# Altium schematic sheet PCB_BLU.SchDoc
size A4
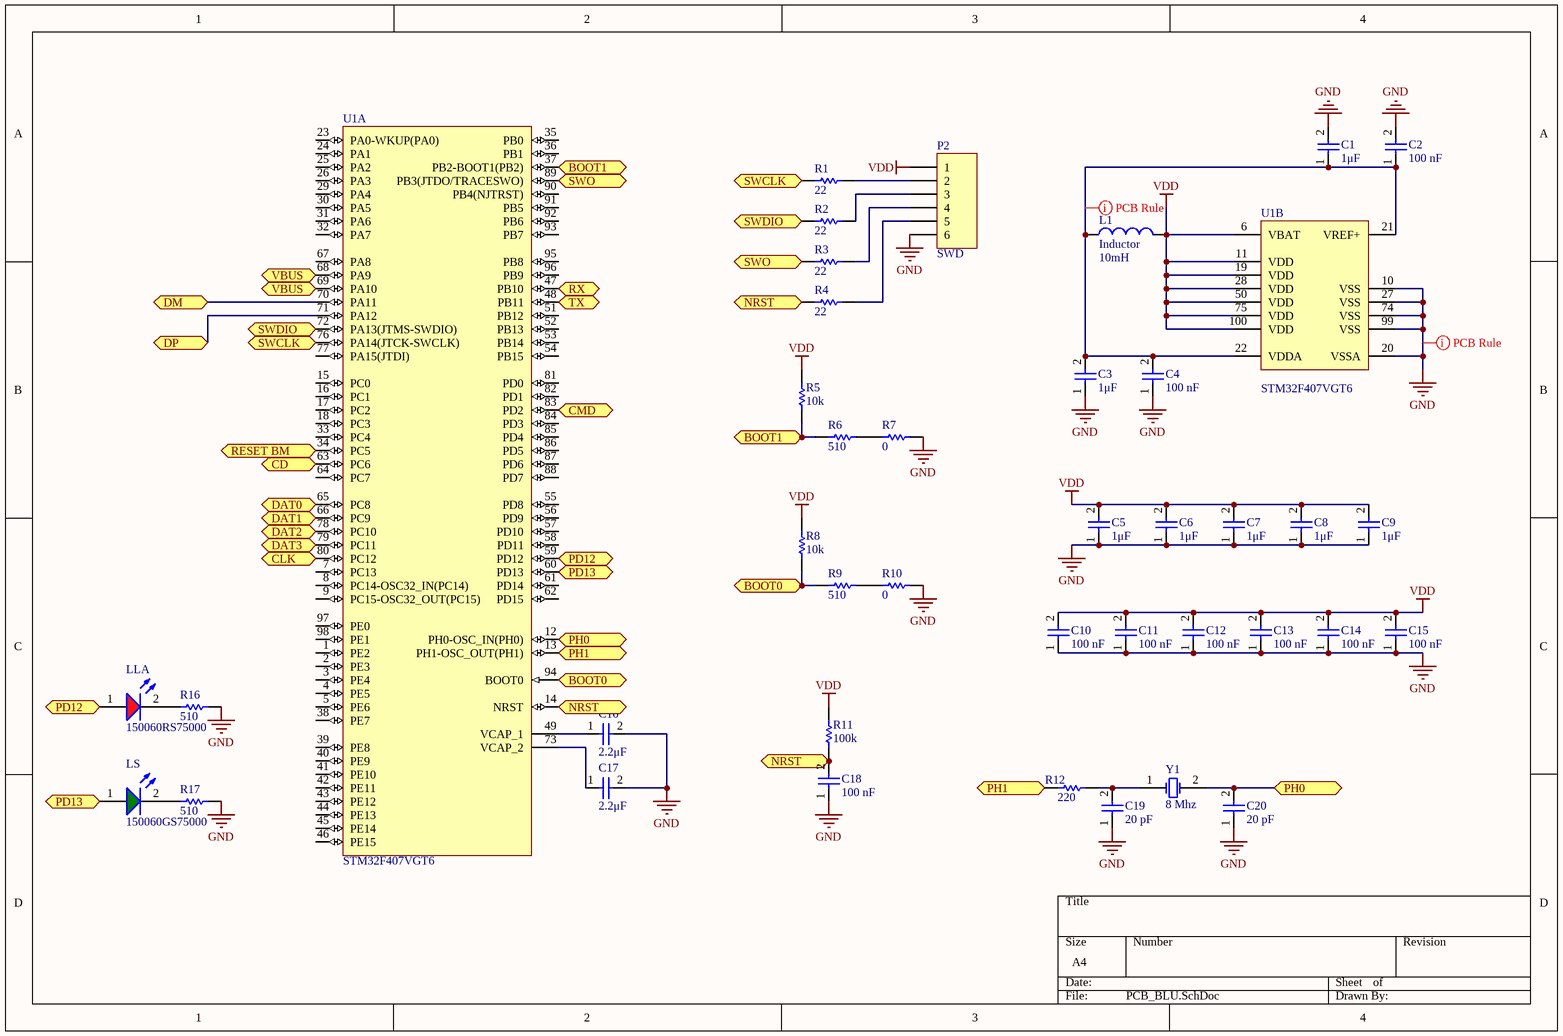
[diagram p0: PCB_BLU.SchDoc]

## Parts
C1  1μF  [WCAP-CSGP 1210, H=1.25mm]
C2  100 nF  [WCAP-CSGP 1206, H=0.8mm]
C3  1μF  [WCAP-CSGP 1210, H=1.25mm]
C4  100 nF  [WCAP-CSGP 1206, H=0.8mm]
C5  1μF  [WCAP-CSGP 1210, H=1.25mm]
C6  1μF  [WCAP-CSGP 1210, H=1.25mm]
C7  1μF  [WCAP-CSGP 1210, H=1.25mm]
C8  1μF  [WCAP-CSGP 1210, H=1.25mm]
C9  1μF  [WCAP-CSGP 1210, H=1.25mm]
C10  100 nF  [WCAP-CSGP 1206, H=0.8mm]
C11  100 nF  [WCAP-CSGP 1206, H=0.8mm]
C12  100 nF  [WCAP-CSGP 1206, H=0.8mm]
C13  100 nF  [WCAP-CSGP 1206, H=0.8mm]
C14  100 nF  [WCAP-CSGP 1206, H=0.8mm]
C15  100 nF  [WCAP-CSGP 1206, H=0.8mm]
C16  2.2μF  [WCAP-CSGP 0805, H=1.25mm]
C17  2.2μF  [WCAP-CSGP 0805, H=1.25mm]
C18  100 nF  [WCAP-CSGP 1206, H=0.8mm]
C19  20 pF  [WCAP-CSGP 0603, H=0.8mm]
C20  20 pF  [WCAP-CSGP 0603, H=0.8mm]
L1  Inductor  value 10mH  [0402-A]
LLA  150060RS75000  [LED_0603_Red]
LS  150060GS75000  [LED_0603_Green]
P2  SWD  [HDR1X6]
R1  22  [RES0402R]
R2  22  [RES0402R]
R3  22  [RES0402R]
R4  22  [RES0402R]
R5  10k  [RES0201R]
R6  510  [RES0201R]
R7  0  [RES0201R]
R8  10k  [RES0201R]
R9  510  [RES0201R]
R10  0  [RES0201R]
R11  100k  [RES0201R]
R12  220  [RES0402R]
R16  510  [RES0402R]
R17  510  [RES0402R]
U1  STM32F407VGT6  [STM-LQFP100_N]  (parts A,B of 2)
Y1  8 Mhz  [3SMXA]

## Ports
BOOT0 (bidir), BOOT1 (bidir), CD (bidir), CLK (bidir), CMD (bidir), DAT0 (bidir), DAT1 (bidir), DAT2 (bidir), DAT3 (bidir), DM (bidir), DP (bidir), NRST (bidir), PD12 (bidir), PD13 (bidir), PH0 (bidir), PH1 (bidir), RESET BM (bidir), RX (bidir), SWCLK (bidir), SWDIO (bidir), SWO (bidir), TX (in), VBUS (bidir)

## Nets
GND: C1.2 C2.2 C3.1 C4.1 C5.1 C6.1 C7.1 C8.1 C9.1 C10.1 C11.1 C12.1 C13.1 C14.1 C15.1 C16.2 C17.2 C18.1 C19.1 C20.1 P2.6 R7.1 R10.1 R16.1 R17.1 U1.10(VSS) U1.20(VSSA) U1.27(VSS) U1.74(VSS) U1.99(VSS)
VDD: C5.2 C6.2 C7.2 C8.2 C9.2 C10.2 C11.2 C12.2 C13.2 C14.2 C15.2 L1.2 P2.1 R5.2 R8.2 R11.1 U1.6(VBAT) U1.11(VDD) U1.19(VDD) U1.28(VDD) U1.50(VDD) U1.75(VDD) U1.100(VDD)
BOOT0: R8.1 R9.2 U1.94(BOOT0) ; port BOOT0
BOOT1: R5.1 R6.2 U1.37(PB2-BOOT1(PB2)) ; port BOOT1
CD: U1.63(PC6) ; port CD
CLK: U1.80(PC12) ; port CLK
CMD: U1.83(PD2) ; port CMD
DAT0: U1.65(PC8) ; port DAT0
DAT1: U1.66(PC9) ; port DAT1
DAT2: U1.78(PC10) ; port DAT2
DAT3: U1.79(PC11) ; port DAT3
DM: U1.70(PA11) ; port DM
DP: U1.71(PA12) ; port DP
NRST: C18.2 R4.2 R11.2 U1.14(NRST) ; port NRST
PD12: LLA.1(A) U1.59(PD12) ; port PD12
PD13: LS.1(A) U1.60(PD13) ; port PD13
PH0: C20.2 U1.12(PH0-OSC_IN(PH0)) Y1.2(OSC2) ; port PH0
PH1: R12.2 U1.13(PH1-OSC_OUT(PH1)) ; port PH1
RESET BM: U1.34(PC5) ; port RESET BM
RX: U1.47(PB10) ; port RX
SWCLK: R1.2 U1.76(PA14(JTCK-SWCLK)) ; port SWCLK
SWDIO: R2.2 U1.72(PA13(JTMS-SWDIO)) ; port SWDIO
SWO: R3.2 U1.89(PB3(JTDO/TRACESWO)) ; port SWO
TX: U1.48(PB11) ; port TX
VBUS: U1.68(PA9) U1.69(PA10) ; port VBUS
NetC1_1: C1.1 C2.1 C3.2 C4.2 L1.1 U1.21(VREF+) U1.22(VDDA)
NetC16_1: C16.1 U1.49(VCAP_1)
NetC17_1: C17.1 U1.73(VCAP_2)
NetC19_2: C19.2 R12.1 Y1.1(OSC1)
NetLLA_2: LLA.2(C) R16.2
NetLS_2: LS.2(C) R17.2
NetP2_2: P2.2 R1.1
NetP2_3: P2.3 R2.1
NetP2_4: P2.4 R3.1
NetP2_5: P2.5 R4.1
NetR6_1: R6.1 R7.2
NetR9_1: R9.1 R10.2

Not connected (* = marked no-connect by the designer): U1 1(PE2) 2(PE3) 3(PE4) 4(PE5) 5(PE6) 7(PC13) 8(PC14-OSC32_IN(PC14)) 9(PC15-OSC32_OUT(PC15)) 15(PC0) 16(PC1) 17(PC2) 18(PC3) 23(PA0-WKUP(PA0)) 24(PA1) 25(PA2) 26(PA3) 29(PA4) 30(PA5) 31(PA6) 32(PA7) 33(PC4) 35(PB0) 36(PB1) 38(PE7) 39(PE8) 40(PE9) 41(PE10) 42(PE11) 43(PE12) 44(PE13) 45(PE14) 46(PE15) 51(PB12) 52(PB13) 53(PB14) 54(PB15) 55(PD8) 56(PD9) 57(PD10) 58(PD11) 61(PD14) 62(PD15) 64(PC7) 67(PA8) 77(PA15(JTDI)) 81(PD0) 82(PD1) 84(PD3) 85(PD4) 86(PD5) 87(PD6) 88(PD7) 90(PB4(NJTRST)) 91(PB5) 92(PB6) 93(PB7) 95(PB8) 96(PB9) 97(PE0) 98(PE1)

## Layout directives
rule Width Constraint [Pref Width = 0.3mil    Min Width = 0.2mil    Max Width = 0.3mil]: GND, NetC1_1

## Library data of the parts
C1 C3 C5-C9 = WCAP-CSGP 1210, 885012209011: WCAP-CSGP MLCC, X7R, 1210, 1μF pF,16Vdc; Manufacturer: Wurth Elektronik; E-mail: libraries@we-online.com; ComponentLink1Description: Manufacturer; ComponentLink1URL: http://www.we-online.com; ComponentLink2Description: Datasheet; ComponentLink2URL: http://katalog.we-online.de/pbs/datasheet/885012209011.pdf; Created by: Karrer Zheng; Created Date: 3/9/2015; Capacitance: 1μF; partNo: 885012209011
C2 C4 C10-C15 C18 = WCAP-CSGP 1206, 885012208009: WCAP-CSGP MLCC, X7R, 1206, 100000 pF,10Vdc; Manufacturer: Wurth Elektronik; E-mail: libraries@we-online.com; ComponentLink1Description: Manufacturer; ComponentLink1URL: http://www.we-online.com; ComponentLink2Description: Datasheet; ComponentLink2URL: http://katalog.we-online.de/pbs/datasheet/885012208009.pdf; Created by: Karrer Zheng; Created Date: 3/9/2015; Capacitance: 100 nF; partNo: 885012208009
C16 C17 = WCAP-CSGP 0805, 885012207024: WCAP-CSGP MLCC, X7R, 0805, 2.2μF ,10Vdc; Manufacturer: Wurth Elektronik; E-mail: libraries@we-online.com; ComponentLink1Description: Manufacturer; ComponentLink1URL: http://www.we-online.com; ComponentLink2Description: Datasheet; ComponentLink2URL: http://katalog.we-online.de/pbs/datasheet/885012207024.pdf; Created by: Karrer Zheng; Created Date: 3/9/2015; Capacitance: 2.2μF; partNo: 885012207024
C19 C20 = WCAP-CSGP 0603, 885012006004: WCAP-CSGP MLCC, NP0, 0603, 22 pF,10Vdc; Manufacturer: Wurth Elektronik; E-mail: libraries@we-online.com; ComponentLink1Description: Manufacturer; ComponentLink1URL: http://www.we-online.com; ComponentLink2Description: Datasheet; ComponentLink2URL: http://katalog.we-online.de/pbs/datasheet/885012006004.pdf; Created by: Karrer Zheng; Created Date: 3/9/2015; Capacitance: 20 pF; partNo: 885012006004
L1 = Inductor: Code_IEC: 1005; Published: 8-Jun-2000; LatestRevisionDate: 29-May-2009; LatestRevisionNote: IPC-7351 Footprint Added.; PackageReference: 0402-A; Publisher: Altium Limited; PackageDescription: Chip Inductor; Code_JEITA: 0402
LLA = WL-SMCW 0603  150060RS75000: SMD mono-color Chip LED, WL-SMCW, Red; Manufacturer: W黵th Elektronik eiSos GmbH; PartNo: 150060RS75000; ComponentLink1Description: Manufacturer; ComponentLink1URL: http://www.we-online.de; Created by: Christin Otto; Created Date: June 2013; ComponentLink2Description: Datasheet; ComponentLink2URL: http://katalog.we-online.com/led/datasheet/150060RS75000.pdf; Color: Red
LS = WL-SMCW 0603  150060GS75000: SMD mono-color Chip LED, WL-SMCW, Green; Manufacturer: W黵th Elektronik eiSos GmbH; PartNo: 150060GS75000; ComponentLink1Description: Manufacturer; ComponentLink1URL: http://www.we-online.de; Created by: Christin Otto; Created Date: June 2013; ComponentLink2Description: Datasheet; ComponentLink2URL: http://katalog.we-online.com/led/datasheet/150060GS75000.pdf; Color: Green
P2 = Header 6: Header, 6-Pin; LatestRevisionDate: 17-Jul-2002; LatestRevisionNote: Re-released for DXP Platform.; Publisher: Altium Limited
R1-R12 R16 R17 = Resistor1: Resistor; Value: =Value
U1 = STM32F407VGT6: ARM Cortex-M4 32-bit MCU+FPU, 210 DMIPS, 1024 kB Flash, 192 kB Internal RAM, 82 I/Os, 100-pin LQFP, -40 to 85 degC, Tray; Manufacturer: STMicroelectronics; D/A Converter: 2x12-bit; FLASH Size (Prog) (kB): 1024; I/Os (High Current): 82; Internal RAM Size (kB): 192; Operating Frequency(F) (Processor speed) (MHz): 168; Supply Voltage(Vcc) max (V): 3.6; Supply Voltage(Vcc) min (V): 1.8; DatasheetVersion: Rev. 4; PackageVersion: Rev. 1, 06/2013; PackageReference: LQFP100; PackageDescription: 100-Pin Low Profile Quad Flat Package, 14 x 14 mm Body, 0.5 mm Pitch; Supplier 1: Digi-Key; Supplier Part Number 1: 497-11605-ND; Supplier 2: Farnell; Supplier Part Number 2: 2064368; Supplier 3: Newark; Supplier Part Number 3: 73T2333; Supplier 4: Mouser; Supplier Part Number 4: 511-STM32F407VGT6; Core: ARM Cortex-M4; Packing: Tray; Mounting Technology: Surface Mount; PartNumber: STM32F407VGT6; ComponentLink1Description: Manufacturer URL; ComponentLink1URL: http://www.st.com/web/en/home.html; ComponentLink2Description: Datasheet; ComponentLink2URL: http://www.st.com/st-web-ui/static/active/en/resource/technical/document/datasheet/DM00037051.pdf; ComponentLink3Description: Package Specification; ComponentLink3URL: http://www.st.com/st-web-ui/static/active/en/resource/technical/document/data_brief/DM00071938.pdf
Y1 = XTAL: Crystal Oscillator; Published: 8-Jun-2000; LatestRevisionDate: 17-Jul-2002; LatestRevisionNote: Re-released for DXP Platform.; PackageReference: R38; Publisher: Altium Limited; PackageDescription: Crystal, Thru-Hole; 2 Leads; Body 3.1 x 8.2 mm (Dia.xH)